# Altium schematic sheet USBtinyISP.SchDoc
size A
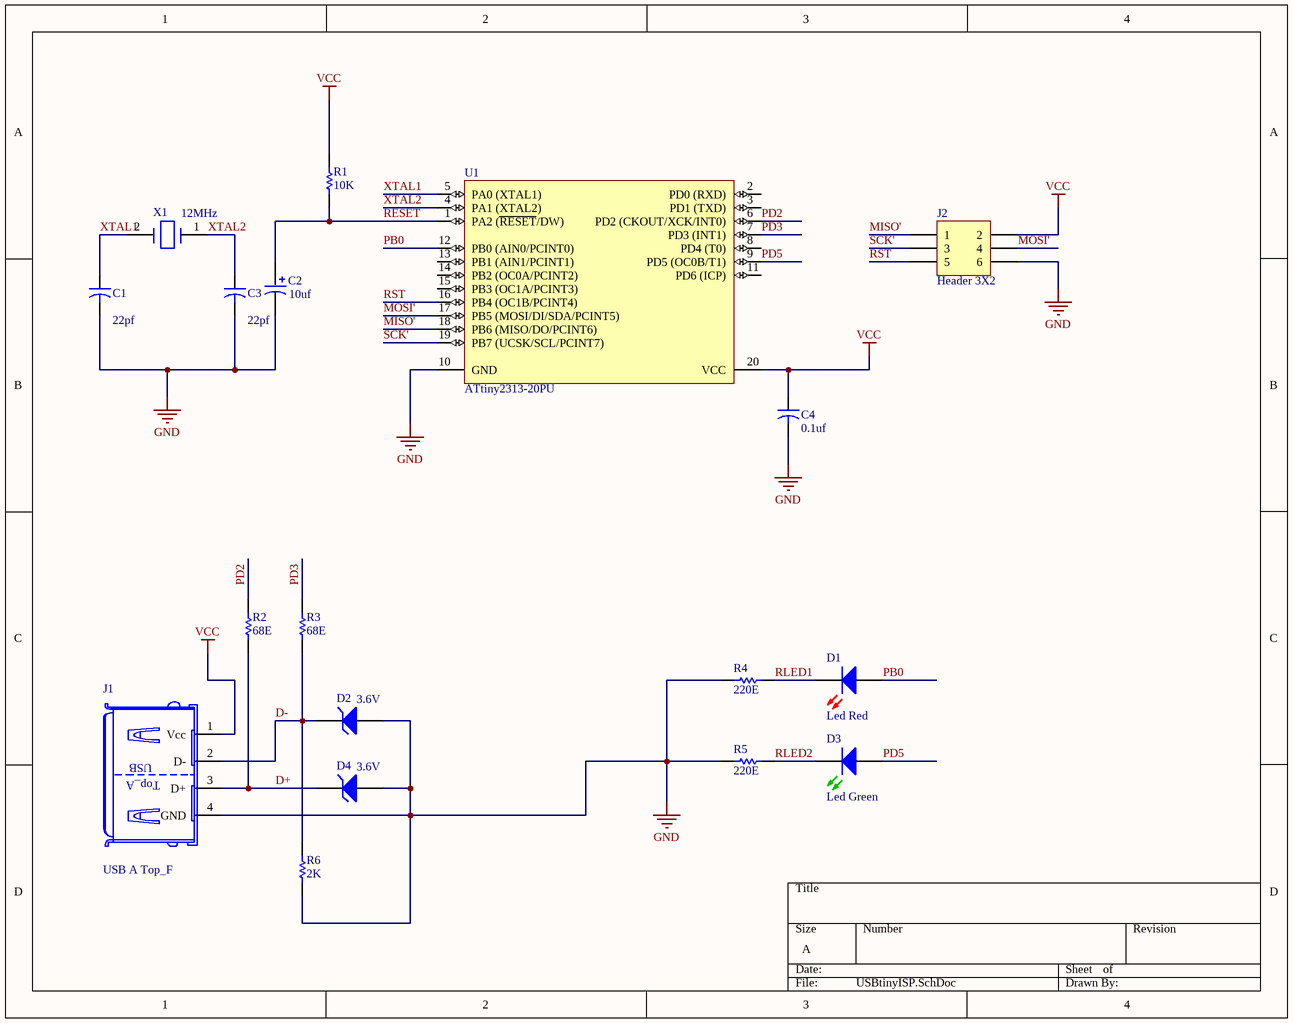
[diagram p0: USBtinyISP.SchDoc]

## Parts
C1  value 22pf  [CAPR5-4X5]  (hidden comment: Cap2)
C2  value 10uf  [CAP-ELECTROLITE]  (hidden comment: Capacitor Polar)
C3  value 22pf  [CAPR5-4X5]  (hidden comment: Cap2)
C4  value 0.1uf  [CAPR5-4X5]  (hidden comment: Cap2)
D1  Led Red  [LED-RED]
D2  value 3.6V  [D Zener]  (hidden comment: Zenor Diode)
D3  Led Green  [LED-GREEN]
D4  value 3.6V  [D Zener]  (hidden comment: Zenor Diode)
J1  USB A Top_F  [USB Type A]
J2  Header 3X2  [HDR2X3]
R1  value 10K  [AXIAL-0.3]  (hidden comment: Res1)
R2  value 68E  [AXIAL-0.3]  (hidden comment: Res1)
R3  value 68E  [AXIAL-0.3]  (hidden comment: Res1)
R4  value 220E  [AXIAL-0.3]  (hidden comment: Res1)
R5  value 220E  [AXIAL-0.3]  (hidden comment: Res1)
R6  value 2K  [AXIAL-0.3]  (hidden comment: Res1)
U1  ATtiny2313-20PU  [20P3]
X1  value 12MHz  [XTAL-SMALL]  (hidden comment: Crystal Small)

## Nets
GND: C1.2 C2.2 C3.2 C4.2 D2.1(A) D4.1(A) J1.4(GND) J2.6 R4.1 R5.1 R6.1 U1.10(GND)
VCC: C4.1 J1.1(Vcc) J2.2 R1.2 U1.20(VCC)
D+: D4.2(K) J1.3(D+) R2.1
D-: D2.2(K) J1.2(D-) R3.1 R6.2
MISO': J2.1 U1.18(PB6_(MISO/DO/PCINT6))
MOSI': J2.4 U1.17(PB5_(MOSI/DI/SDA/PCINT5))
PB0: D1.1(A) U1.12(PB0_(AIN0/PCINT0))
PD2: R2.2 U1.6(PD2_(CKOUT/XCK/INT0))
PD3: R3.2 U1.7(PD3_(INT1))
PD5: D3.1(A) U1.9(PD5_(OC0B/T1))
RESET: C2.1 R1.1 U1.1(PA2_(~{RESET}/DW))
RLED1: D1.2(K) R4.2
RLED2: D3.2(K) R5.2
RST: J2.5 U1.16(PB4_(OC1B/PCINT4))
SCK': J2.3 U1.19(PB7_(UCSK/SCL/PCINT7))
XTAL1: C1.1 U1.5(PA0_(XTAL1)) X1.2(OSC2)
XTAL2: C3.1 U1.4(PA1_(XTAL2)) X1.1(OSC1)

Not connected (* = marked no-connect by the designer): U1 2(PD0_(RXD)) 3(PD1_(TXD)) 8(PD4_(T0)) 11(PD6_(ICP)) 13(PB1_(AIN1/PCINT1)) 14(PB2_(OC0A/PCINT2)) 15(PB3_(OC1A/PCINT3))

## Notes on the sheet
- (in symbol USB A Top_F) USB; Top_A

## Library data of the parts
C1 C3 C4 = Cap2: Capacitor; Published: 23-Sep-2002; PackageReference: CAPR5-4X5; Publisher: Altium Limited; PackageDescription: Capacitor; 2 Leads
C2 = Cap- polarized
J2 = Header 3X2: Header, 3-Pin, Dual row; LatestRevisionDate: 17-Jul-2002; LatestRevisionNote: Re-released for DXP Platform.; Publisher: Altium Limited
R1-R6 = Res1: Resistor; Published: 8-Jun-2000; LatestRevisionDate: 17-Jul-2002; LatestRevisionNote: Re-released for DXP Platform.; PackageReference: AXIAL-0.3; Publisher: Altium Limited; PackageDescription: Axial Device, Thru-Hole; 2 Leads; 0.3 in Pin Spacing
U1 = ATtiny2313-20PU: Low Power tinyAVR® 8-Bit Microcontroller, 2K Flash Memory, 20MHz, Industrial Temperature, 20-Lead PDIP, Pb-Free; Published: 20-Nov-2009; DatasheetVersion: DOC2543B, Mar-2009; PackageVersion: revC, Jan-2004; PackageReference: 20P3; Publisher: Altium Limited; PackageDescription: 20-lead (0.300"/7.62mm Wide) Plastic Dual Inline Package (PDIP); Supplier 1: Digi-Key; Supplier Part Number 1: ATTINY2313-20PU-ND; Supplier 2: Farnell; Supplier Part Number 2: 9171592; Supplier 3: Mouser; Supplier Part Number 3: 556-ATTINY2313-20PU; Code_JEDEC: MS-001-AD; ComponentLink1Description: Manufacturer Link; ComponentLink1URL: http://www.atmel.com/products/AVR/tinyavr.asp?; ComponentLink2Description: Datasheet; ComponentLink2URL: http://www.atmel.com/dyn/resources/prod_documents/doc2543.pdf; ComponentLink3Description: Atmel.com Home; ComponentLink3URL: http://www.atmel.com
X1 = Crystal Small: Crystal Oscillator; Published: 8-Jun-2000; LatestRevisionDate: 17-Jul-2002; LatestRevisionNote: Re-released for DXP Platform.; PackageReference: R38; Publisher: Altium Limited
D1 = Led Red: Published: 8-Jun-2000; LatestRevisionDate: 17-Dec-2003; LatestRevisionNote: PCB Footprint replaced.; DatasheetVersion: 16-Apr-2002; PackageVersion: 16-Apr-2002; PackageReference: 3.5X2.8X1.9; Publisher: Altium Limited
D2 D4 = Zenor Diode: Published: 8-Jun-2000; LatestRevisionDate: 17-Jul-2002; LatestRevisionNote: Re-released for DXP Platform.; PackageReference: DIODE-0.7; Publisher: Altium Limited
D3 = Led Green: Published: 8-Jun-2000; LatestRevisionDate: 08-Jul-2005; LatestRevisionNote: Mech Layer 1 removed.; PackageReference: LED-1; Publisher: Altium Limited